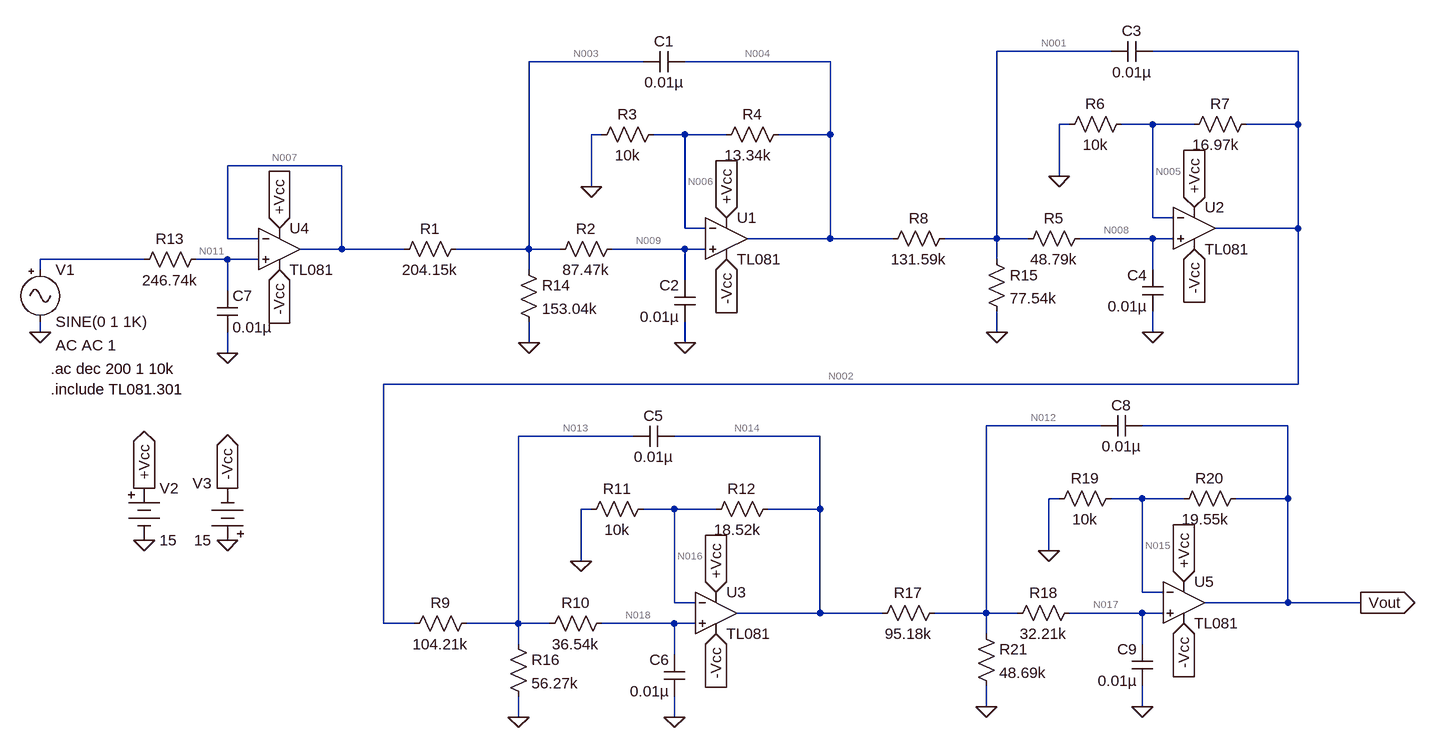
[diagram p0: schematic 9th order Chebyshev filter.asc]
9th order Chebyshev filter.asc, the LTspice schematic file:
Version 4
SHEET 1 2320 916
WIRE 1088 -144 912 -144
WIRE 1376 -144 1152 -144
WIRE 368 -128 192 -128
WIRE 656 -128 432 -128
WIRE 1024 -32 1008 -32
WIRE 1152 -32 1104 -32
WIRE 1216 -32 1152 -32
WIRE 1376 -32 1376 -144
WIRE 1376 -32 1296 -32
WIRE 304 -16 288 -16
WIRE 432 -16 384 -16
WIRE 496 -16 432 -16
WIRE 656 -16 656 -128
WIRE 656 -16 576 -16
WIRE -96 32 -272 32
WIRE 1008 48 1008 -32
WIRE 288 64 288 -16
WIRE 1152 112 1152 -32
WIRE 1184 112 1152 112
WIRE 432 128 432 -16
WIRE 464 128 432 128
WIRE 1376 128 1376 -32
WIRE 1376 128 1248 128
WIRE -272 144 -272 32
WIRE -224 144 -272 144
WIRE 656 144 656 -16
WIRE 656 144 528 144
WIRE 752 144 656 144
WIRE 912 144 912 -144
WIRE 912 144 832 144
WIRE 960 144 912 144
WIRE 1152 144 1040 144
WIRE 1184 144 1152 144
WIRE -96 160 -96 32
WIRE -96 160 -160 160
WIRE 0 160 -96 160
WIRE 192 160 192 -128
WIRE 192 160 80 160
WIRE 240 160 192 160
WIRE 432 160 320 160
WIRE 464 160 432 160
WIRE -400 176 -560 176
WIRE -272 176 -320 176
WIRE -224 176 -272 176
WIRE 912 176 912 144
WIRE -560 192 -560 176
WIRE 192 192 192 160
WIRE 1152 192 1152 144
WIRE 432 208 432 160
WIRE -272 224 -272 176
WIRE -560 288 -560 272
WIRE 912 288 912 256
WIRE 1152 288 1152 256
WIRE 192 304 192 272
WIRE 432 304 432 272
WIRE -272 320 -272 288
WIRE 1376 368 1376 128
WIRE 1376 368 -32 368
WIRE 1072 432 896 432
WIRE 1360 432 1136 432
WIRE 352 448 176 448
WIRE 640 448 416 448
WIRE 1008 544 992 544
WIRE 1136 544 1088 544
WIRE 1200 544 1136 544
WIRE 1360 544 1360 432
WIRE 1360 544 1280 544
WIRE 288 560 272 560
WIRE 416 560 368 560
WIRE 480 560 416 560
WIRE 640 560 640 448
WIRE 640 560 560 560
WIRE 992 624 992 544
WIRE 272 640 272 560
WIRE 1136 688 1136 544
WIRE 1168 688 1136 688
WIRE 416 704 416 560
WIRE 448 704 416 704
WIRE 1360 704 1360 544
WIRE 1360 704 1232 704
WIRE 1472 704 1360 704
WIRE 640 720 640 560
WIRE 640 720 512 720
WIRE 736 720 640 720
WIRE 896 720 896 432
WIRE 896 720 816 720
WIRE 944 720 896 720
WIRE 1136 720 1024 720
WIRE 1168 720 1136 720
WIRE -32 736 -32 368
WIRE 16 736 -32 736
WIRE 176 736 176 448
WIRE 176 736 96 736
WIRE 224 736 176 736
WIRE 416 736 304 736
WIRE 448 736 416 736
WIRE 896 752 896 720
WIRE 176 768 176 736
WIRE 1136 768 1136 720
WIRE 416 784 416 736
WIRE 896 864 896 832
WIRE 1136 864 1136 832
WIRE 176 880 176 848
WIRE 416 880 416 848
FLAG 432 304 0
FLAG 288 64 0
FLAG -560 288 0
FLAG -400 608 0
FLAG -272 608 0
FLAG -400 528 +Vcc
IOPIN -400 528 Out
FLAG -272 528 -Vcc
IOPIN -272 528 Out
FLAG 496 112 +Vcc
IOPIN 496 112 In
FLAG 496 176 -Vcc
IOPIN 496 176 In
FLAG 1152 288 0
FLAG 1008 48 0
FLAG 1216 96 +Vcc
IOPIN 1216 96 In
FLAG 1216 160 -Vcc
IOPIN 1216 160 In
FLAG 416 880 0
FLAG 272 640 0
FLAG 480 688 +Vcc
IOPIN 480 688 In
FLAG 480 752 -Vcc
IOPIN 480 752 In
FLAG -192 128 +Vcc
IOPIN -192 128 In
FLAG -192 192 -Vcc
IOPIN -192 192 In
FLAG -272 320 0
FLAG 192 304 0
FLAG 912 288 0
FLAG 176 880 0
FLAG 1136 864 0
FLAG 992 624 0
FLAG 1200 672 +Vcc
IOPIN 1200 672 In
FLAG 1200 736 -Vcc
IOPIN 1200 736 In
FLAG 1472 704 Vout
IOPIN 1472 704 Out
FLAG 896 864 0
SYMBOL res 96 144 R90
WINDOW 0 0 56 VBottom 2
WINDOW 3 32 56 VTop 2
SYMATTR InstName R1
SYMATTR Value 204.15k
SYMBOL res 336 144 R90
WINDOW 0 0 56 VBottom 2
WINDOW 3 32 56 VTop 2
SYMATTR InstName R2
SYMATTR Value 87.47k
SYMBOL res 400 -32 R90
WINDOW 0 0 56 VBottom 2
WINDOW 3 32 56 VTop 2
SYMATTR InstName R3
SYMATTR Value 10k
SYMBOL res 592 -32 R90
WINDOW 0 0 56 VBottom 2
WINDOW 3 32 63 VTop 2
SYMATTR InstName R4
SYMATTR Value 13.34k
SYMBOL cap 432 -144 R90
WINDOW 0 0 32 VBottom 2
WINDOW 3 32 32 VTop 2
SYMATTR InstName C1
SYMATTR Value 0.01µ
SYMBOL cap 448 272 R180
WINDOW 0 24 56 Left 2
WINDOW 3 24 8 Left 2
SYMATTR InstName C2
SYMATTR Value 0.01µ
SYMBOL Misc\\signal -560 176 R0
WINDOW 123 24 132 Left 2
WINDOW 39 0 0 Left 0
SYMATTR Value2 AC AC 1
SYMATTR InstName V1
SYMBOL Misc\\battery -400 512 R0
WINDOW 123 0 0 Left 0
WINDOW 39 0 0 Left 0
SYMATTR InstName V2
SYMATTR Value 15
SYMBOL Misc\\battery -272 624 R180
WINDOW 0 24 104 Left 2
WINDOW 3 24 16 Left 2
WINDOW 123 0 0 Left 0
WINDOW 39 0 0 Left 0
SYMATTR InstName V3
SYMATTR Value 15
SYMBOL res 1056 128 R90
WINDOW 0 0 56 VBottom 2
WINDOW 3 32 56 VTop 2
SYMATTR InstName R5
SYMATTR Value 48.79k
SYMBOL res 1120 -48 R90
WINDOW 0 0 56 VBottom 2
WINDOW 3 32 56 VTop 2
SYMATTR InstName R6
SYMATTR Value 10k
SYMBOL res 1312 -48 R90
WINDOW 0 0 56 VBottom 2
WINDOW 3 32 63 VTop 2
SYMATTR InstName R7
SYMATTR Value 16.97k
SYMBOL cap 1152 -160 R90
WINDOW 0 0 32 VBottom 2
WINDOW 3 32 32 VTop 2
SYMATTR InstName C3
SYMATTR Value 0.01µ
SYMBOL cap 1168 256 R180
WINDOW 0 24 56 Left 2
WINDOW 3 24 8 Left 2
SYMATTR InstName C4
SYMATTR Value 0.01µ
SYMBOL res 848 128 R90
WINDOW 0 0 56 VBottom 2
WINDOW 3 32 56 VTop 2
SYMATTR InstName R8
SYMATTR Value 131.59k
SYMBOL res 112 720 R90
WINDOW 0 0 56 VBottom 2
WINDOW 3 32 56 VTop 2
SYMATTR InstName R9
SYMATTR Value 104.21k
SYMBOL res 320 720 R90
WINDOW 0 0 56 VBottom 2
WINDOW 3 32 56 VTop 2
SYMATTR InstName R10
SYMATTR Value 36.54k
SYMBOL res 384 544 R90
WINDOW 0 0 56 VBottom 2
WINDOW 3 32 56 VTop 2
SYMATTR InstName R11
SYMATTR Value 10k
SYMBOL res 576 544 R90
WINDOW 0 0 56 VBottom 2
WINDOW 3 32 63 VTop 2
SYMATTR InstName R12
SYMATTR Value 18.52k
SYMBOL cap 416 432 R90
WINDOW 0 0 32 VBottom 2
WINDOW 3 32 32 VTop 2
SYMATTR InstName C5
SYMATTR Value 0.01µ
SYMBOL cap 432 848 R180
WINDOW 0 24 56 Left 2
WINDOW 3 24 8 Left 2
SYMATTR InstName C6
SYMATTR Value 0.01µ
SYMBOL OpAmps\\opamp2 496 80 R0
SYMATTR InstName U1
SYMATTR Value TL081
SYMBOL OpAmps\\opamp2 1216 64 R0
SYMATTR InstName U2
SYMATTR Value TL081
SYMBOL OpAmps\\opamp2 480 656 R0
SYMATTR InstName U3
SYMATTR Value TL081
SYMBOL OpAmps\\opamp2 -192 96 R0
SYMATTR InstName U4
SYMATTR Value TL081
SYMBOL res -304 160 R90
WINDOW 0 0 56 VBottom 2
WINDOW 3 32 56 VTop 2
SYMATTR InstName R13
SYMATTR Value 246.74k
SYMBOL cap -288 224 R0
SYMATTR InstName C7
SYMATTR Value 0.01µ
SYMBOL res 176 176 R0
SYMATTR InstName R14
SYMATTR Value 153.04k
SYMBOL res 896 160 R0
SYMATTR InstName R15
SYMATTR Value 77.54k
SYMBOL res 160 752 R0
SYMATTR InstName R16
SYMATTR Value 56.27k
SYMBOL res 832 704 R90
WINDOW 0 0 56 VBottom 2
WINDOW 3 32 56 VTop 2
SYMATTR InstName R17
SYMATTR Value 95.18k
SYMBOL res 1040 704 R90
WINDOW 0 0 56 VBottom 2
WINDOW 3 32 56 VTop 2
SYMATTR InstName R18
SYMATTR Value 32.21k
SYMBOL res 1104 528 R90
WINDOW 0 0 56 VBottom 2
WINDOW 3 32 56 VTop 2
SYMATTR InstName R19
SYMATTR Value 10k
SYMBOL res 1296 528 R90
WINDOW 0 0 56 VBottom 2
WINDOW 3 32 63 VTop 2
SYMATTR InstName R20
SYMATTR Value 19.55k
SYMBOL cap 1136 416 R90
WINDOW 0 0 32 VBottom 2
WINDOW 3 32 32 VTop 2
SYMATTR InstName C8
SYMATTR Value 0.01µ
SYMBOL cap 1152 832 R180
WINDOW 0 24 56 Left 2
WINDOW 3 24 8 Left 2
SYMATTR InstName C9
SYMATTR Value 0.01µ
SYMBOL OpAmps\\opamp2 1200 640 R0
SYMATTR InstName U5
SYMATTR Value TL081
SYMBOL res 880 736 R0
SYMATTR InstName R21
SYMATTR Value 48.69k
TEXT -544 344 Left 2 !.ac dec 200 1 10k
TEXT -544 376 Left 2 !.include TL081.301

The netlist it stands for:
* 9th order Chebyshev filter.asc
R1 N003 N007 204.15k
R2 N009 N003 87.47k
R3 N006 0 10k
R4 N004 N006 13.34k
C1 N004 N003 0.01µ
C2 0 N009 0.01µ
V1 N010 0 SINE(0 1 1K) AC AC 1
V2 +Vcc 0 15
V3 0 -Vcc 15
R5 N008 N001 48.79k
R6 N005 0 10k
R7 N002 N005 16.97k
C3 N002 N001 0.01µ
C4 0 N008 0.01µ
R8 N001 N004 131.59k
R9 N013 N002 104.21k
R10 N018 N013 36.54k
R11 N016 0 10k
R12 N014 N016 18.52k
C5 N014 N013 0.01µ
C6 0 N018 0.01µ
XU1 N009 N006 +Vcc -Vcc N004 TL081  ; pins In+ In- V+ V- OUT
XU2 N008 N005 +Vcc -Vcc N002 TL081  ; pins In+ In- V+ V- OUT
XU3 N018 N016 +Vcc -Vcc N014 TL081  ; pins In+ In- V+ V- OUT
XU4 N011 N007 +Vcc -Vcc N007 TL081  ; pins In+ In- V+ V- OUT
R13 N011 N010 246.74k
C7 N011 0 0.01µ
R14 N003 0 153.04k
R15 N001 0 77.54k
R16 N013 0 56.27k
R17 N012 N014 95.18k
R18 N017 N012 32.21k
R19 N015 0 10k
R20 Vout N015 19.55k
C8 Vout N012 0.01µ
C9 0 N017 0.01µ
XU5 N017 N015 +Vcc -Vcc Vout TL081  ; pins In+ In- V+ V- OUT
R21 N012 0 48.69k
.ac dec 200 1 10k
.include TL081.301
.backanno
.end

* Results of the author's LTspice run, read from the files saved beside the schematic
* Operating Point, zero values left out:
*   V(n003) = -4.003 µV
*   V(n007) = -145.4 nV
*   V(n009) = -7.944 µV
*   V(n006) = 3.027 µV
*   V(n004) = 7.666 µV
*   V(+vcc) = 15 V
*   V(-vcc) = -15 V
*   V(n008) = -1.554 µV
*   V(n001) = 644.2 nV
*   V(n005) = 9.417 µV
*   V(n002) = 26.16 µV
*   V(n013) = 7.527 µV
*   V(n018) = 5.881 µV
*   V(n016) = 16.85 µV
*   V(n014) = 48.89 µV
*   V(n011) = -11.12 µV
*   V(n012) = 15.1 µV
*   V(n017) = 13.64 µV
*   V(n015) = 24.61 µV
*   V(vout) = 73.62 µV
*   I(R1) = -18.9 pA
*   I(R2) = -45.05 pA
*   I(R3) = 302.7 pA
*   I(R4) = 347.8 pA
*   I(R5) = -45.05 pA
*   I(R6) = 941.7 pA
*   I(R7) = 986.7 pA
*   I(R8) = -53.36 pA
*   I(R9) = -178.8 pA
*   I(R10) = -45.05 pA
*   I(R11) = 1.685 nA
*   I(R12) = 1.73 nA
*   I(R13) = -45.05 pA
*   I(R14) = -26.16 pA
*   I(R15) = 8.308 pA
*   I(R16) = 133.8 pA
*   I(R17) = -355.1 pA
*   I(R18) = -45.05 pA
*   I(R19) = 2.461 nA
*   I(R20) = 2.507 nA
*   I(R21) = 310 pA
*   I(V1) = -45.05 pA
*   I(V2) = -70.97 mA
*   I(V3) = -70.97 mA
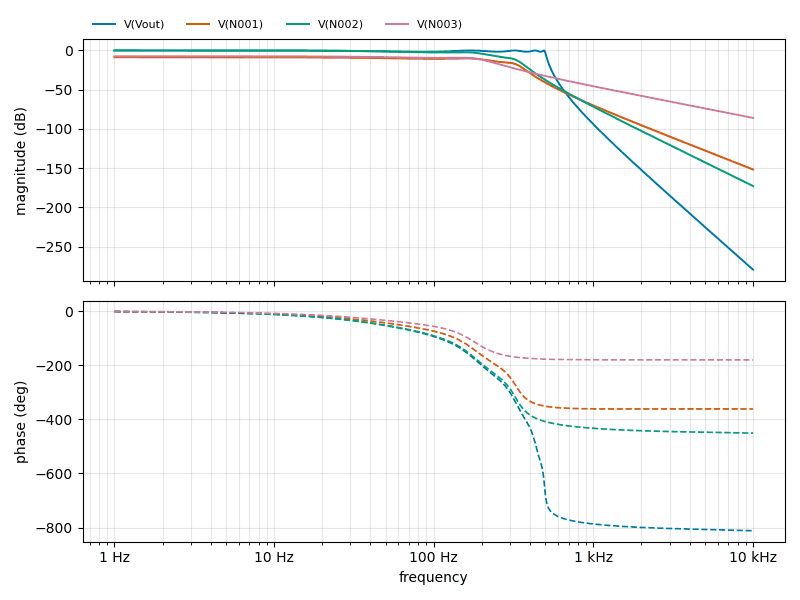
[diagram p1: AC Analysis of 9th order Chebyshev filter.asc, plotted from the saved traces]
* AC Analysis, 1 run:
*   V(Vout): -0.00 dB at 1 Hz, -279.55 dB at 10 kHz, peak 0.08 dB at 489.8 Hz, 3 dB below the peak at 499.4 Hz
*   V(N001): -8.62 dB at 1 Hz, -151.76 dB at 10 kHz, peak -8.62 dB at 1 Hz, 3 dB below the peak at 203.8 Hz
*   V(N002): -0.00 dB at 1 Hz, -172.87 dB at 10 kHz, peak -0.00 dB at 1 Hz, 3 dB below the peak at 182 Hz
*   V(N003): -7.36 dB at 1 Hz, -85.98 dB at 10 kHz, peak -7.36 dB at 1 Hz, 3 dB below the peak at 182.4 Hz